# EasyEDA schematic Desoldering Station V5_2021-04-11.json

## Sheets
1 Sheet_1: TITLE: Soldering / Desoldering Station V5; REV: 5.3; Date: 2021-04-11; Sheet: 1/2; Drawn By: ctbully@gmail.com; Company: Arduino Community
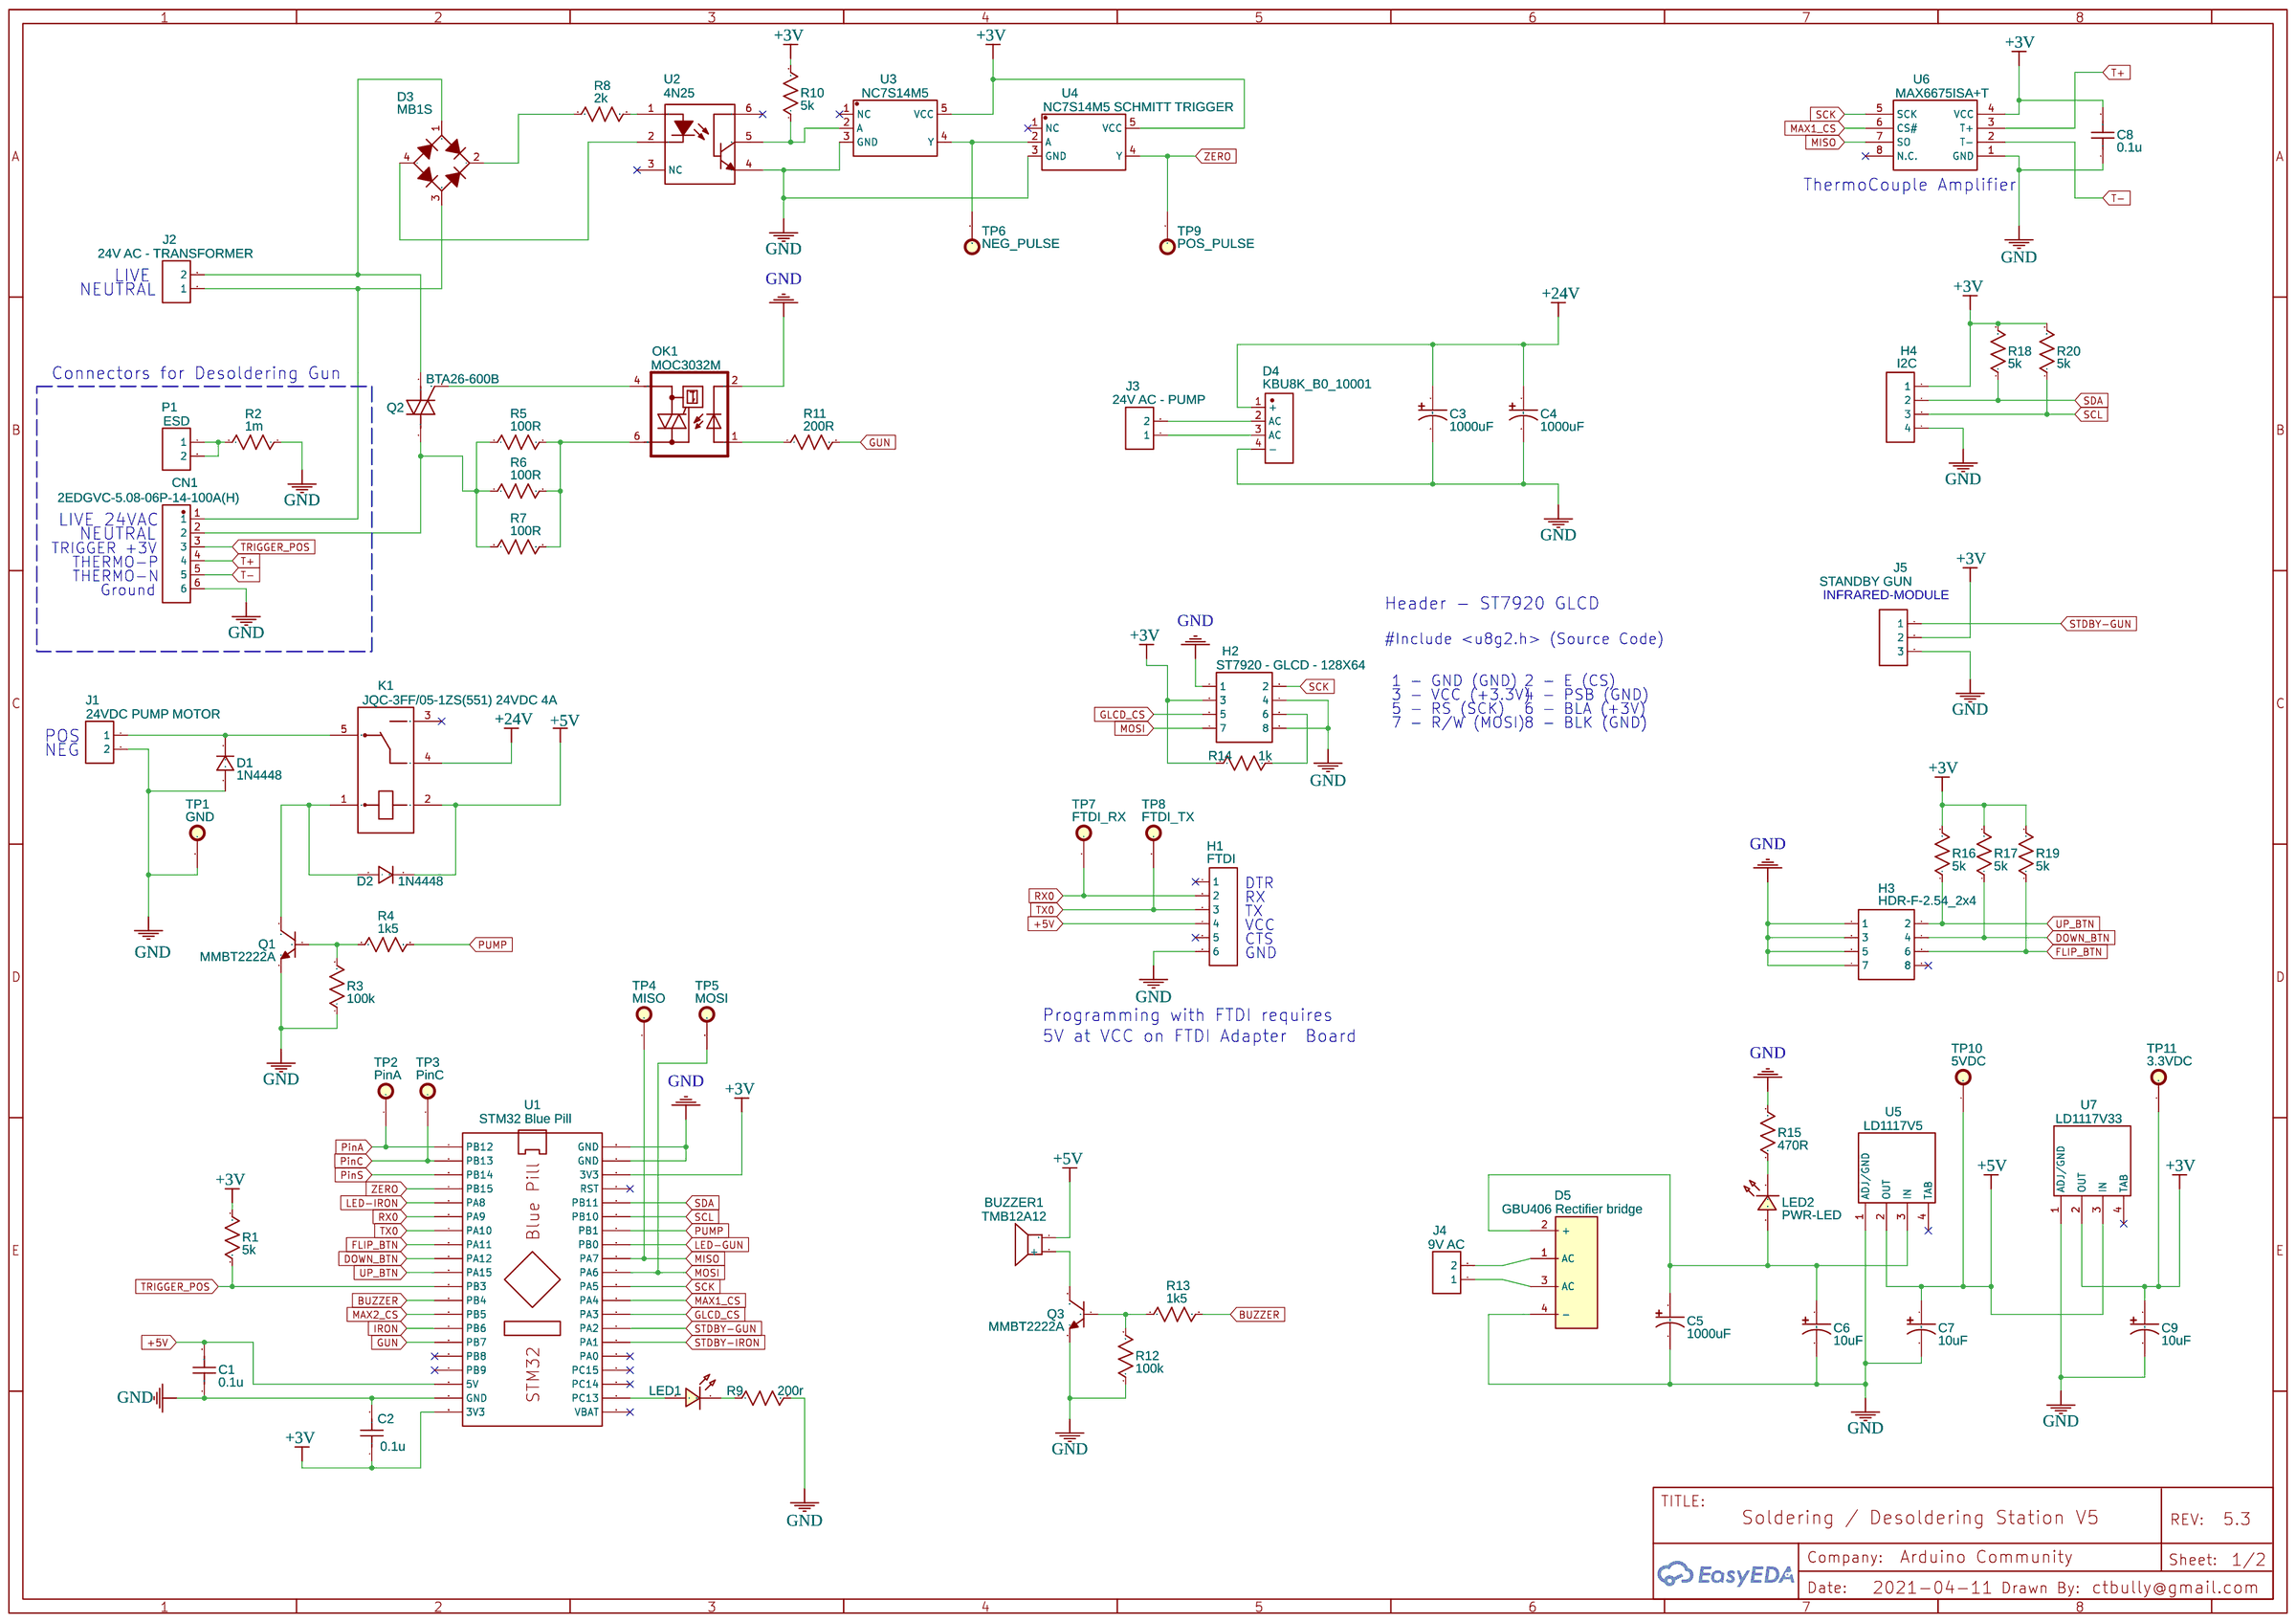
[diagram p0: Sheet_1]
2 Sheet_2: Sheet: 2/2
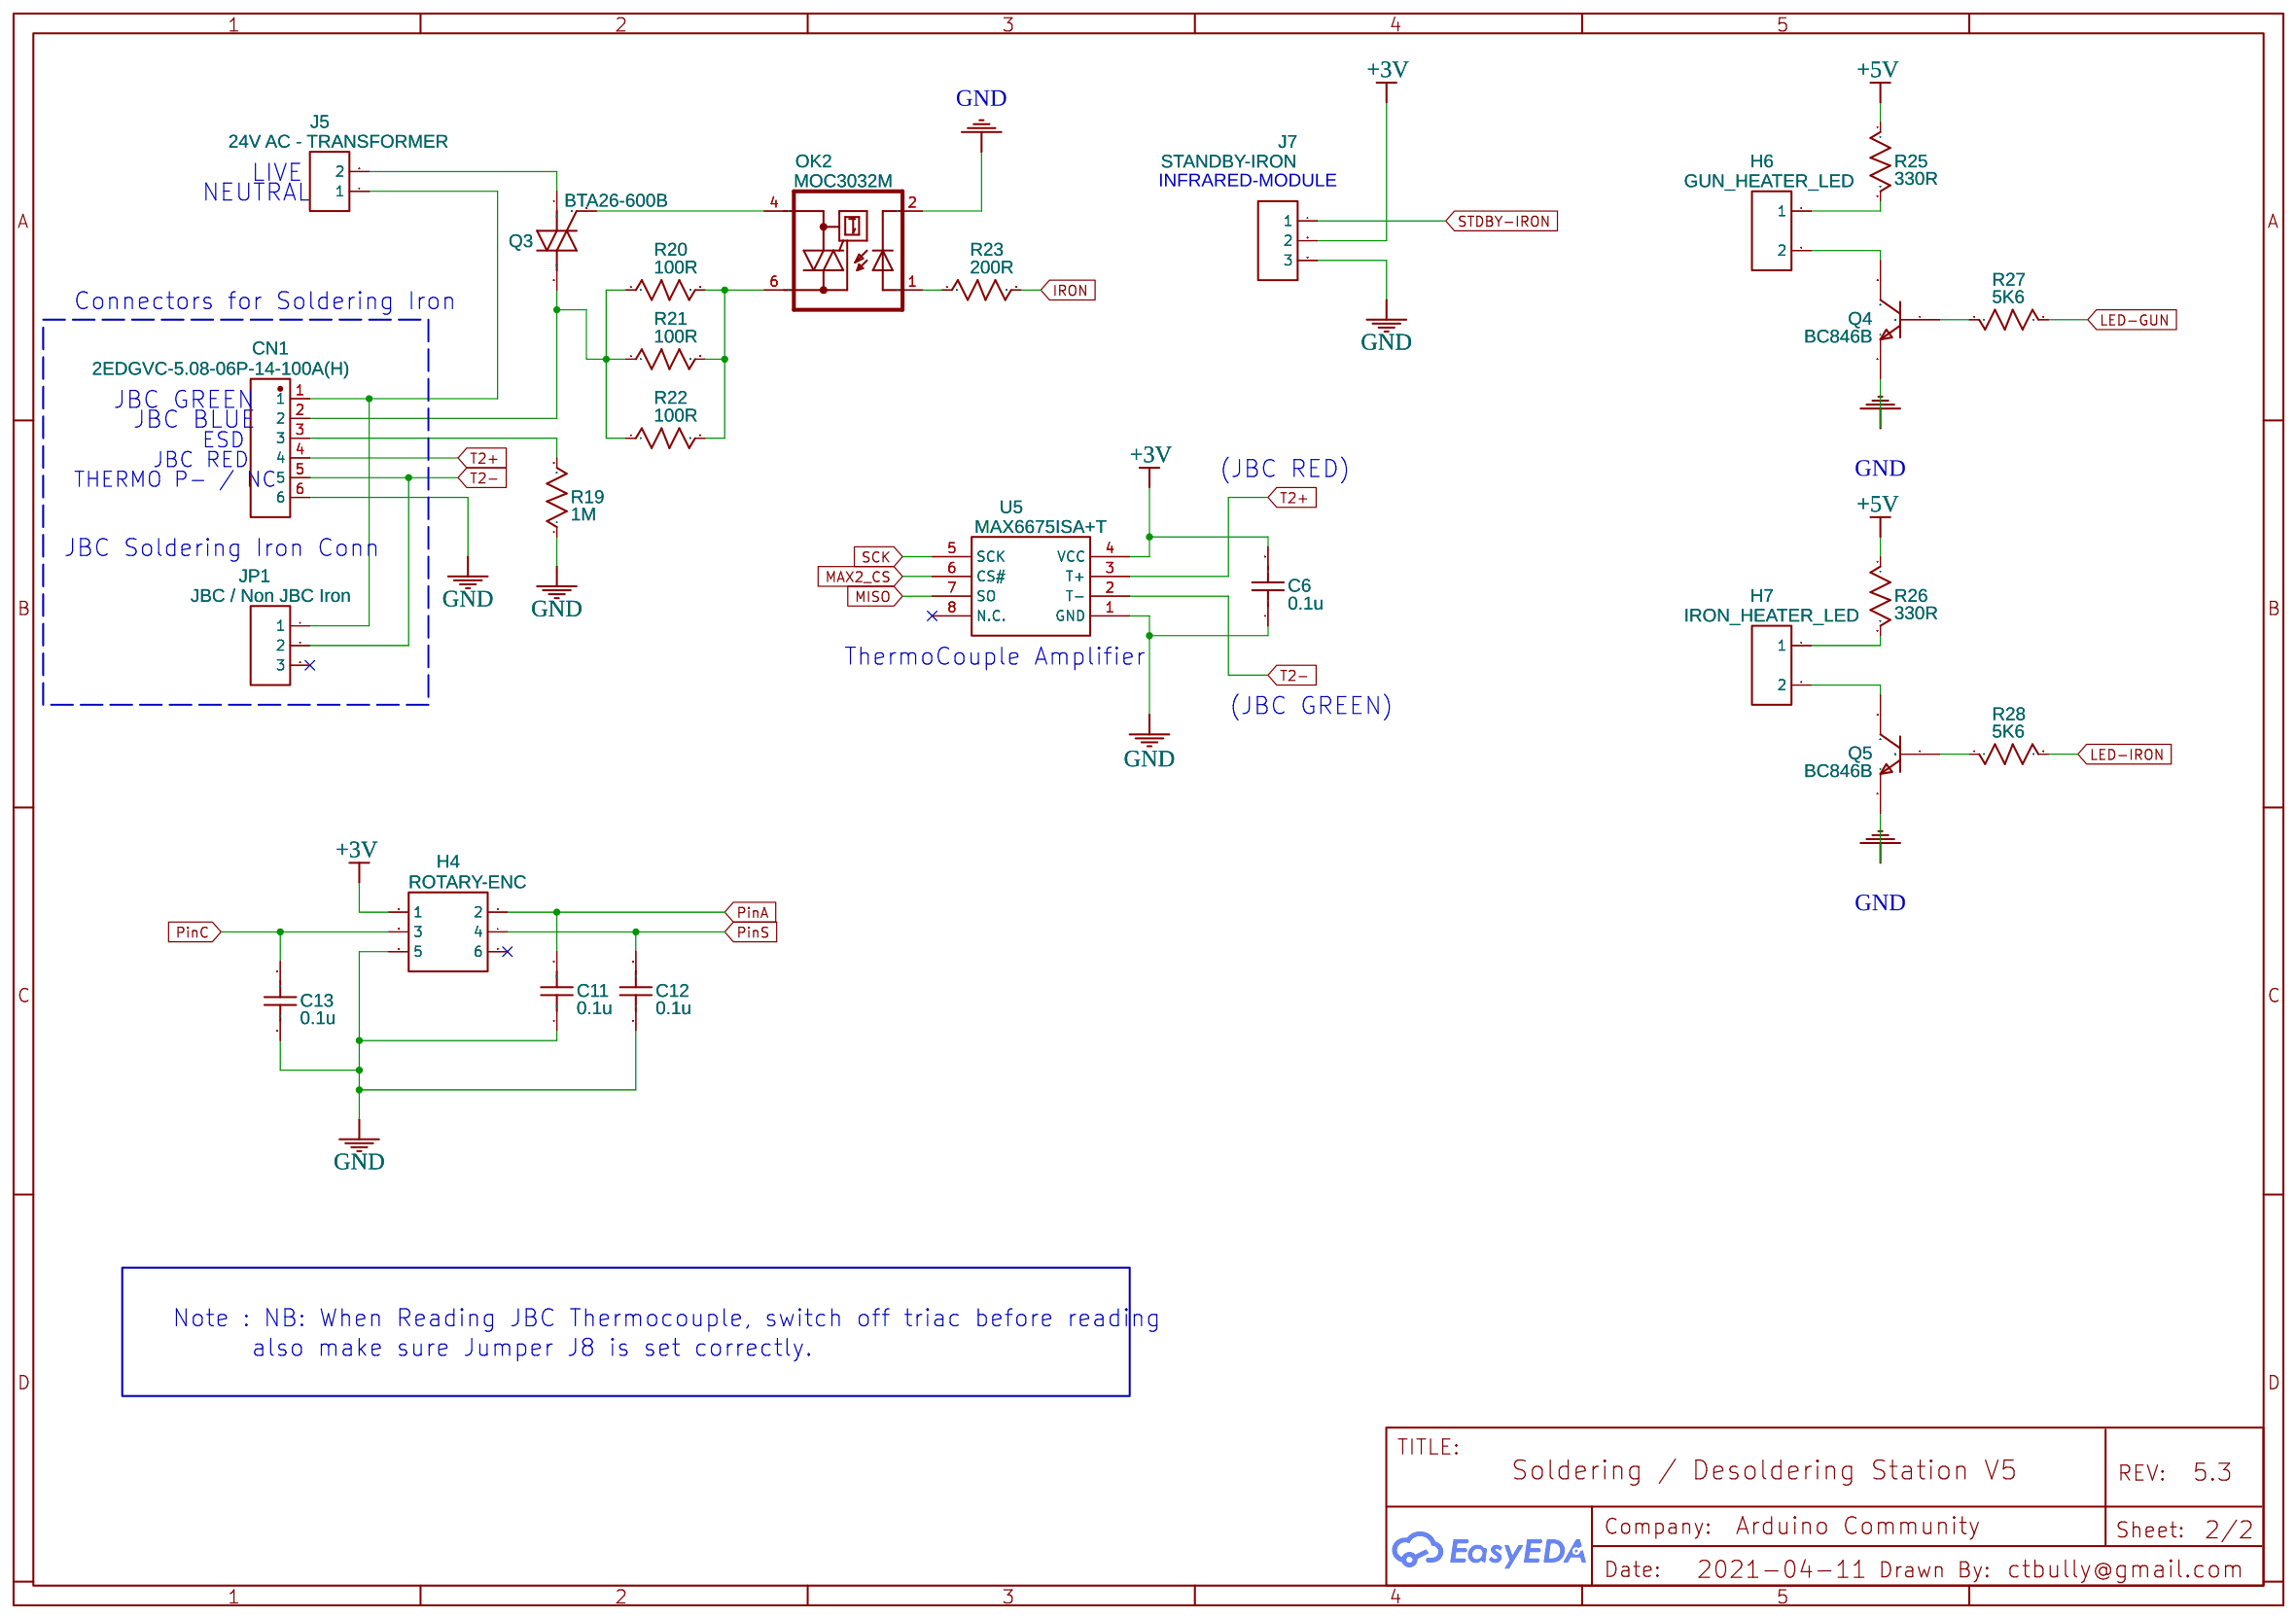
[diagram p1: Sheet_2]

## Parts
sheet Sheet_1
BUZZER1  TMB12A12  [BUZ-TH_BD12.0-P7.60-D0.6-FD]
C1  0.1u  [C0805]
C2  0.1u  [C0805]
C3  1000uF  [CAP-SMD_BD10.0-L10.3-W10.3-RD]
C4  1000uF  [CAP-SMD_BD10.0-L10.3-W10.3-RD]
C5  1000uF  [CAP-SMD_BD10.0-L10.3-W10.3-RD]
C6  10uF  [CAP-SMD_BD4.0-L4.3-W4.3-FD]
C7  10uF  [CAP-SMD_BD4.0-L4.3-W4.3-FD]
C8  0.1u  [C0805]
C9  10uF  [CAP-SMD_BD4.0-L4.3-W4.3-FD]
CN1  2EDGVC-5.08-06P-14-100A(H)  [CONN-TH_6P-P5.08_2EDGV-5.08-06P-14-100A-H]
D1  1N4448  [DO-214AA_L5.6-W4.0-RD]
D2  1N4448  [DO-214AA_L5.6-W4.0-RD]
D3  MB1S  [DIO-BG-SMD_4P-L4.9-W4.0-P2.54-LS7.0-BL]
D4  KBU8K_B0_10001  [KBU_4P-L23.2-W6.8-P5.10]
D5  GBU406 Rectifier bridge  [DIO-BG-TH_GBU406]
H1  FTDI  [HDR-F-2.54_1X6]
H2  ST7920 - GLCD - 128X64  [HDR-F-2.54_2X4]
H3  HDR-F-2.54_2x4  [HDR-F-2.54_2X4]
H4  I2C  [HDR-F-2.54_1X4]
J1  24VDC PUMP MOTOR  [CONN-TH_2P-P5.08]
J2  24V AC - TRANSFORMER  [CONN-TH_2P-P5.08]
J3  24V AC - PUMP  [CONN-TH_2P-P5.08]
J4  9V AC  [CONN-TH_2P-P5.08]
J5  STANDBY GUN  [HDR-M-2.54_1X3]
K1  JQC-3FF/05-1ZS(551) 24VDC 4A  [RELAY-TH_HF3FF-XX-1ZXX-XXX]
LED1  LED-0603_R  [LED0603_RED]
LED2  PWR-LED  [LED0603_RED]
OK1  MOC3032M  [DIL06]
P1  ESD  [CONN-TH_2P-P5.00]
Q1  MMBT2222A  [SOT-23-3_L2.9-W1.3-P1.90-LS2.4-BR]
Q2  BTA26-600B  [TO-3PN_L15.8-W5.0-P5.45-L]
Q3  MMBT2222A  [SOT-23-3_L2.9-W1.3-P1.90-LS2.4-BR]
R1  5k  [R0805]
R2  1m  [R0603]
R3  100k  [R0805]
R4  1k5  [R0805]
R5  100R  [R0805]
R6  100R  [R0805]
R7  100R  [R0805]
R8  2k  [R0805]
R9  200r  [R0805]
R10  5k  [R0805]
R11  200R  [R0805]
R12  100k  [R0805]
R13  1k5  [R0805]
R14  1k  [R0805]
R15  470R  [R0805]
R16  5k  [R0805]
R17  5k  [R0805]
R18  5k  [R0603]
R19  5k  [R0805]
R20  5k  [R0603]
TP1  GND  [TESTPIN]
TP2  PinA  [TESTPIN]
TP3  PinC  [TESTPIN]
TP4  MISO  [TESTPIN]
TP5  MOSI  [TESTPIN]
TP6  NEG_PULSE  [TESTPIN]
TP7  FTDI_RX  [TESTPIN]
TP8  FTDI_TX  [TESTPIN]
TP9  POS_PULSE  [TESTPIN]
TP10  5VDC  [TESTPIN]
TP11  3.3VDC  [TESTPIN]
U1  STM32 Blue Pill  [STM32F103C8T6 BLUE PILL]
U2  4N25  [DIP-6_L7.3-W6.5-P2.54-LS7.6-BL]
U3  NC7S14M5  [SOT-23-5_L3.0-W1.7-P0.95-LS2.8-BL]
U4  NC7S14M5 SCHMITT TRIGGER  [SOT-23-5_L3.0-W1.7-P0.95-LS2.8-BL]
U5  LD1117V5  [MY LM1117-5.0]
U6  MAX6675ISA+T  [SOIC-8_L5.0-W4.0-P1.27-LS6.0-BL]
U7  LD1117V33  [MY LM1117-5.0]
sheet Sheet_2
C6#2  0.1u  [C0805]
C11  0.1u  [C0603]
C12  0.1u  [C0603]
C13  0.1u  [C0603]
CN1#2  2EDGVC-5.08-06P-14-100A(H)  [CONN-TH_6P-P5.08_2EDGV-5.08-06P-14-100A-H]
H4#2  ROTARY-ENC  [HDR-F-2.54_2X3]
H6  GUN_HEATER_LED  [HDR-2X1/2.54]
H7  IRON_HEATER_LED  [HDR-2X1/2.54]
J5#2  24V AC - TRANSFORMER  [CONN-TH_2P-P5.08]
J7  STANDBY-IRON  [HDR-M-2.54_1X3]
JP1  JBC / Non JBC Iron  [HDR-M-2.54_1X3]
OK2  MOC3032M  [DIL06]
Q3#2  BTA26-600B  [TO-3PN_L15.8-W5.0-P5.45-L]
Q4  BC846B  [SOT23-3]
Q5  BC846B  [SOT23-3]
R19#2  1M  [R0805]
R20#2  100R  [R0805]
R21  100R  [R0805]
R22  100R  [R0805]
R23  200R  [R0805]
R25  330R  [R0805]
R26  330R  [R0805]
R27  5K6  [R0805]
R28  5K6  [R0805]
U5#2  MAX6675ISA+T  [SOIC-8_L5.0-W4.0-P1.27-LS6.0-BL]

## Library data of the parts
BUZZER1 = TMB12A12: Supplier: LCSC; Manufacturer: HNDZ; Supplier Part: C96079; LCSC Assembly: Yes; SMT Type: Extend; Paste Type: expand
C1 C11-C13 = C_0603_US: Contributor: LCEDA_Lib
C2 C6#2 C8 = C_0201_US: Contributor: LCEDA_Lib
C3-C5 = VE-102M1C1010-TRO: Supplier: LCSC; Supplier Part: C249474; Manufacturer: Lelon; Contributor: LCSC; SMT Type: Extend; JLCPCB SMD: Yes; LCSC Assembly: Yes; Paste Type: expand
C6 = VZH100M1C0406-TRO: Supplier: LCSC; Supplier Part: C249815; Manufacturer: Lelon; Contributor: LCSC
C7 C9 = VE-100M1A0405-TRO: Supplier: LCSC; Supplier Part: C249449; Manufacturer: Lelon; Contributor: LCSC
CN1 CN1#2 = 2EDGVC-5.08-06P-14-100A(H): Supplier: LCSC; Supplier Part: C691856; Manufacturer: DEGSON; Contributor: LCSC; LCSC Assembly: Yes; SMT Type: Extend; Paste Type: expand
D1 D2 = 1N4448: Supplier: LCSC; Manufacturer: DIODES; Manufacturer Part: 1N4448HLP-7; image: //image.lceda.cn/szlcsc/C54037.jpg; Supplier Part: C154874
D3 = MB1S: Supplier: LCSC; Manufacturer: MDD; image: //image.lceda.cn/szlcsc/C19728.jpg; Supplier Part: C19728; Paste Type: expand
D4 = KBU8K_B0_10001: Supplier: LCSC; Supplier Part: C391525; Manufacturer: PANJIT International; Contributor: LCSC; LCSC Assembly: Yes; SMT Type: Extend; Paste Type: expand
D5 = GBU406 Rectifier bridge: Supplier: LCSC; Manufacturer: MDD; image: //image.lceda.cn/szlcsc/C13432.jpg; Supplier Part: C13432
H1 = HDR-F-2.54_1x6: Supplier Part: C40877; Supplier: LCSC; Contributor: LCEDA_Lib
H2 H3 = HDR-F-2.54_2x4: Supplier Part: C239344; Supplier: LCSC; Contributor: LCEDA_Lib
H4 = HDR-F-2.54_1x4: Supplier Part: C225501; Supplier: LCSC; Contributor: LCEDA_Lib
J1 = HDR-M-2.54_1x2: Supplier Part: C124375; Supplier: LCSC; Contributor: LCEDA_Lib; Package Display: No
J2-J4 J5#2 = HDR-M-2.54_1x2: Supplier Part: C124375; Supplier: LCSC; Contributor: LCEDA_Lib
J5 J7 JP1 = HDR-M-2.54_1x3: Supplier Part: C180248; Supplier: LCSC; Contributor: LCEDA_Lib
K1 = JQC-3FF/05-1ZS(551): Supplier: LCSC; Manufacturer: HF; image: //image.lceda.cn/szlcsc/C9221.jpg; Supplier Part: C9221; LCSC Assembly: Yes; SMT Type: Extend; Paste Type: expand
LED1 LED2 = LED-0603_R: Manufacturer: Wuxi ARK Tech Elec; Manufacturer Part: D-W060306W1-KS2; Supplier Part: C118340; Supplier: LCSC; Contributor: LCEDA_01
OK1 OK2 = MOC3032M: 6-Pin DIP Zero-Cross Optoisolators Triac Driver Output (250400 Volt Peak); Supplier: LCSC; Manufacturer: ON Semicon; Supplier Part: C463338
P1 = CONN-TH_2P-P5.00: Supplier: LCSC; Contributor: LCEDA_Lib
Q1 Q3 = MMBT2222A: Supplier: LCSC; Supplier Part: C909758; Manufacturer: GOODWORK(固得沃克); Contributor: LCSC
Q2 Q3#2 = BTA26-600BWRG: Supplier: LCSC; Supplier Part: C283477; Manufacturer: STMicroelectronics; Contributor: LCSC; LCSC Assembly: Yes; SMT Type: Extend; Paste Type: expand
R1-R4 R9 R12-R15 R18 R20 = R_0603_US: Contributor: LCEDA_Lib
R5-R8 R11 R16 R17 R19 R19#2 R20#2 R21-R23 = R_0201_US: Contributor: LCEDA_Lib
R10 = R_0805_US: Contributor: LCEDA_Lib
TP1-TP11 = TestPin: Contributor: alan.green; sourceId: WTb5nFXR9
U1 = STM32 Blue Pill: Manufacturer Part: LM338T P+; Contributor: svartalf
U2 = 4N25: Supplier: LCSC; Manufacturer: LITEON; Manufacturer Part: 4N25S; Contributor: LCSC; Supplier Part: C143074
U3 = NC7S14M5: Supplier: LCSC; Supplier Part: C7416; Manufacturer: FAIRCHILD; Manufacturer Part: NC7S14M5X; Contributor: LCSC; SMT Type: Extend; JLCPCB SMD: Yes; LCSC Assembly: Yes; Paste Type: expand
U4 = NC7S14M5: Supplier: LCSC; Supplier Part: C184444; Manufacturer: ON Semicon; Contributor: LCSC; SMT Type: Extend; JLCPCB SMD: Yes; LCSC Assembly: Yes; Paste Type: expand
U5 = MY LM1117S-5.0: Supplier: LCSC; Manufacturer: HGC(Huaguan Semicon); Manufacturer Part: AMS1117-5.0; Supplier Part: C498116; LCSC Assembly: Yes; SMT Type: Extend
U5#2 U6 = MAX6675ISA+T: Supplier: LCSC; Manufacturer: MAXIM; image: //image.lceda.cn/szlcsc/C16030.jpg; Supplier Part: C16030; SMT Type: Extend; JLCPCB SMD: Yes; Paste Type: recommend
U7 = MY LM1117S-5.0: Supplier: LCSC; Manufacturer: SK; Manufacturer Part: AMS1117-3.3; Supplier Part: C165482; LCSC Assembly: Yes; SMT Type: Extend
H4#2 = HDR-F-2.54_2x3: Supplier Part: C65114; Supplier: LCSC; Contributor: LCEDA_Lib
H6 H7 = -: Supplier: LCSC; Manufacturer: TE Connectivity; Manufacturer Part: 826629-2; image: //image.lceda.cn/szlcsc/C86471.jpg; Supplier Part: C86471
Q4 Q5 = BC846B: NPN General-purpose Transistor; Supplier: LCSC; Manufacturer: Hottech; Supplier Part: C181138
R25-R28 = Res_AXIAL-0.3(1/8W)_US: Manufacturer Part: ?

## Nets
+3V: C2.1 C6#2.2 C8.2 C9.1 H2.3 H4.1 H4#2.1 J5.2 J7.2 R1.2 R10.2 R14.2 R16.2 R17.2 R18.2 R19.2 R20.2 TP11.1 U1.20(3V3) U1.38(3V3) U3.5(VCC) U4.5(VCC) U5#2.4(VCC) U6.4(VCC) U7.2(OUT)
+5V: BUZZER1.2 C1.2 C7.1 D2.2(K) H1.4 K1.2 R25.1 R26.1 TP10.1 U1.18(5V) U5.2(OUT) U7.3(IN)
+24V: C3.1 C4.1 D4.1(+) K1.4
GND: C1.1 C2.2 C3.2 C4.2 C5.2 C6.2 C6#2.1 C7.2 C8.1 C9.2 C11.1 C12.1 C13.2 CN1.6 CN1#2.6 D1.1(A) D4.4(-) D5.4(-) H1.6 H2.1 H2.4 H2.8 H3.1 H3.3 H3.5 H3.7 H4.4 H4#2.5 J1.2 J5.3 J7.3 OK1.2(C) OK2.2(C) Q1.2(E) Q3.2(E) Q4.2(E) Q5.2(E) R2.1 R3.1 R9.2 R12.1 R15.2 R19#2.1 TP1.1 U1.19(GND) U1.39(GND) U1.40(GND) U2.4 U3.3(GND) U4.3(GND) U5.1(ADJ/GND) U5#2.1(GND) U6.1(GND) U7.1(ADJ/GND)
BUZZER: R13.2 U1.12(PB4)
DOWN_BTN: H3.4 R17.1 U1.9(PA12)
FLIP_BTN: H3.6 R19.1 U1.8(PA11)
GLCD_CS: H2.5 U1.28(PA3)
GUN: R11.2 U1.15(PB7)
IRON: R23.2 U1.14(PB6)
LED-GUN: R27.2 U1.33(PB0)
LED-IRON: R28.2 U1.5(PA8)
MAX1_CS: U1.29(PA4) U6.6(CS#)
MAX2_CS: U1.13(PB5) U5#2.6(CS#)
MISO: TP4.1 U1.32(PA7) U5#2.7(SO) U6.7(SO)
MOSI: H2.7 TP5.1 U1.31(PA6)
PinA: C11.2 H4#2.2 TP2.1 U1.1(PB12)
PinC: C13.1 H4#2.3 TP3.1 U1.2(PB13)
PinS: C12.2 H4#2.4 U1.3(PB14)
PUMP: R4.2 U1.34(PB1)
RX0: H1.2 TP7.1 U1.6(PA9)
SCK: H2.2 U1.30(PA5) U5#2.5(SCK) U6.5(SCK)
SCL: H4.3 R20.1 U1.35(PB10)
SDA: H4.2 R18.1 U1.36(PB11)
STDBY-GUN: J5.1 U1.27(PA2)
STDBY-IRON: J7.1 U1.26(PA1)
T2+: CN1#2.4 U5#2.3(T+)
T2-: CN1#2.5 JP1.2 U5#2.2(T-)
T+: CN1.4 U6.3(T+)
T-: CN1.5 U6.2(T-)
TRIGGER_POS: CN1.3 R1.1 U1.11(PB3)
TX0: H1.3 TP8.1 U1.7(PA10)
UP_BTN: H3.2 R16.1 U1.10(PA15)
ZERO: TP9.1 U1.4(PB15) U4.4(Y)
Net-(BUZZER1-1): BUZZER1.1(+) Q3.3(C)
Net-(C5-1): C5.1 C6.1 D5.2(+) LED2.1 U5.3(IN)
Net-(CN1#2-1): CN1#2.1 J5#2.1 JP1.1
Net-(CN1#2-2): CN1#2.2 Q3#2.2(A2) R20#2.1 R21.1 R22.1
Net-(CN1#2-3): CN1#2.3 R19#2.2
Net-(CN1-1): CN1.1 D3.3(C2) J2.1
Net-(CN1-2): CN1.2 Q2.2(A2) R5.1 R6.1 R7.1
Net-(D1-2): D1.2(K) J1.1 K1.5
Net-(D2-1): D2.1(A) K1.1 Q1.3(C)
Net-(D3-1): D3.1(C1) J2.2 Q2.1(A1)
Net-(D3-2): D3.2(+) R8.1
Net-(D3-4): D3.4(-) U2.2
Net-(D4-2): D4.2(AC) J3.2
Net-(D4-3): D4.3(AC) J3.1
Net-(D5-1): D5.1(AC) J4.2
Net-(D5-3): D5.3(AC) J4.1
Net-(H2-6): H2.6 R14.1
Net-(H6-1): H6.1 R25.2
Net-(H6-2): H6.2 Q4.3(C)
Net-(H7-1): H7.1 R26.2
Net-(H7-2): H7.2 Q5.3(C)
Net-(J5#2-2): J5#2.2 Q3#2.1(A1)
Net-(LED1-1): LED1.1 U1.22(PC13)
Net-(LED1-2): LED1.2 R9.1
Net-(LED2-2): LED2.2 R15.1
Net-(OK1-1): OK1.1(A) R11.1
Net-(OK1-4): OK1.4(A1) Q2.3(G)
Net-(OK1-6): OK1.6(A2) R5.2 R6.2 R7.2
Net-(OK2-1): OK2.1(A) R23.1
Net-(OK2-4): OK2.4(A1) Q3#2.3(G)
Net-(OK2-6): OK2.6(A2) R20#2.2 R21.2 R22.2
Net-(P1-1): P1.1 P1.2 R2.2
Net-(Q1-1): Q1.1(B) R3.2 R4.1
Net-(Q3-1): Q3.1(B) R12.2 R13.1
Net-(Q4-1): Q4.1(B) R27.1
Net-(Q5-1): Q5.1(B) R28.1
Net-(R8-2): R8.2 U2.1
Net-(R10-1): R10.1 U2.5 U3.2(A)
Net-(TP6-1): TP6.1 U3.4(Y) U4.2(A)

Not connected (* = marked no-connect by the designer): H1 1* 5*; H3 8*; H4#2 6*; JP1 3*; K1 3*; U1 16(PB8)* 17(PB9)* 21(VBAT)* 23(PC14)* 24(PC15)* 25(PA0)* 37(RST)*; U2 3(NC)* 6*; U3 1(NC)*; U4 1(NC)*; U5 4(TAB)*; U5#2 8(N.C.)*; U6 8(N.C.)*; U7 4(TAB)*

## Notes on the sheets
sheet 1
- ThermoCouple Amplifier
- LIVE
- NEUTRAL
- Connectors for Desoldering Gun
- LIVE 24VAC
- NEUTRAL
- TRIGGER +3V
- THERMO-P
- THERMO-N
- Ground
- INFRARED-MODULE
- Header - ST7920 GLCD
- #Include <u8g2.h> (Source Code)
- 1 - GND (GND)
- 2 - E (CS)
- 3 - VCC (+3.3V)
- 4 - PSB (GND)
- 5 - RS (SCK)
- 6 - BLA (+3V)
- 7 - R/W (MOSI)
- 8 - BLK (GND)
- POS
- NEG
- DTR
- RX
- TX
- VCC
- CTS
- GND
- Programming with FTDI requires
- 5V at VCC on FTDI Adapter  Board
sheet 2
- LIVE
- NEUTRAL
- INFRARED-MODULE
- Connectors for Soldering Iron
- JBC GREEN
- JBC BLUE
- ESD
- JBC RED
- (JBC RED)
- THERMO P- / NC
- JBC Soldering Iron Conn
- ThermoCouple Amplifier
- (JBC GREEN)
- Note : NB: When Reading JBC Thermocouple, switch off triac before reading
- also make sure Jumper J8 is set correctly.
